# Altium schematic sheet PowerBoard.SchDoc: DriveHUB CardFrame - Backplane Power
size A3; Date: 01/08/22; Engineer: AJC; DocumentNumber: 35-735; Revision: D; SheetNumber: 1; SheetTotal: 3; Manager: AJC
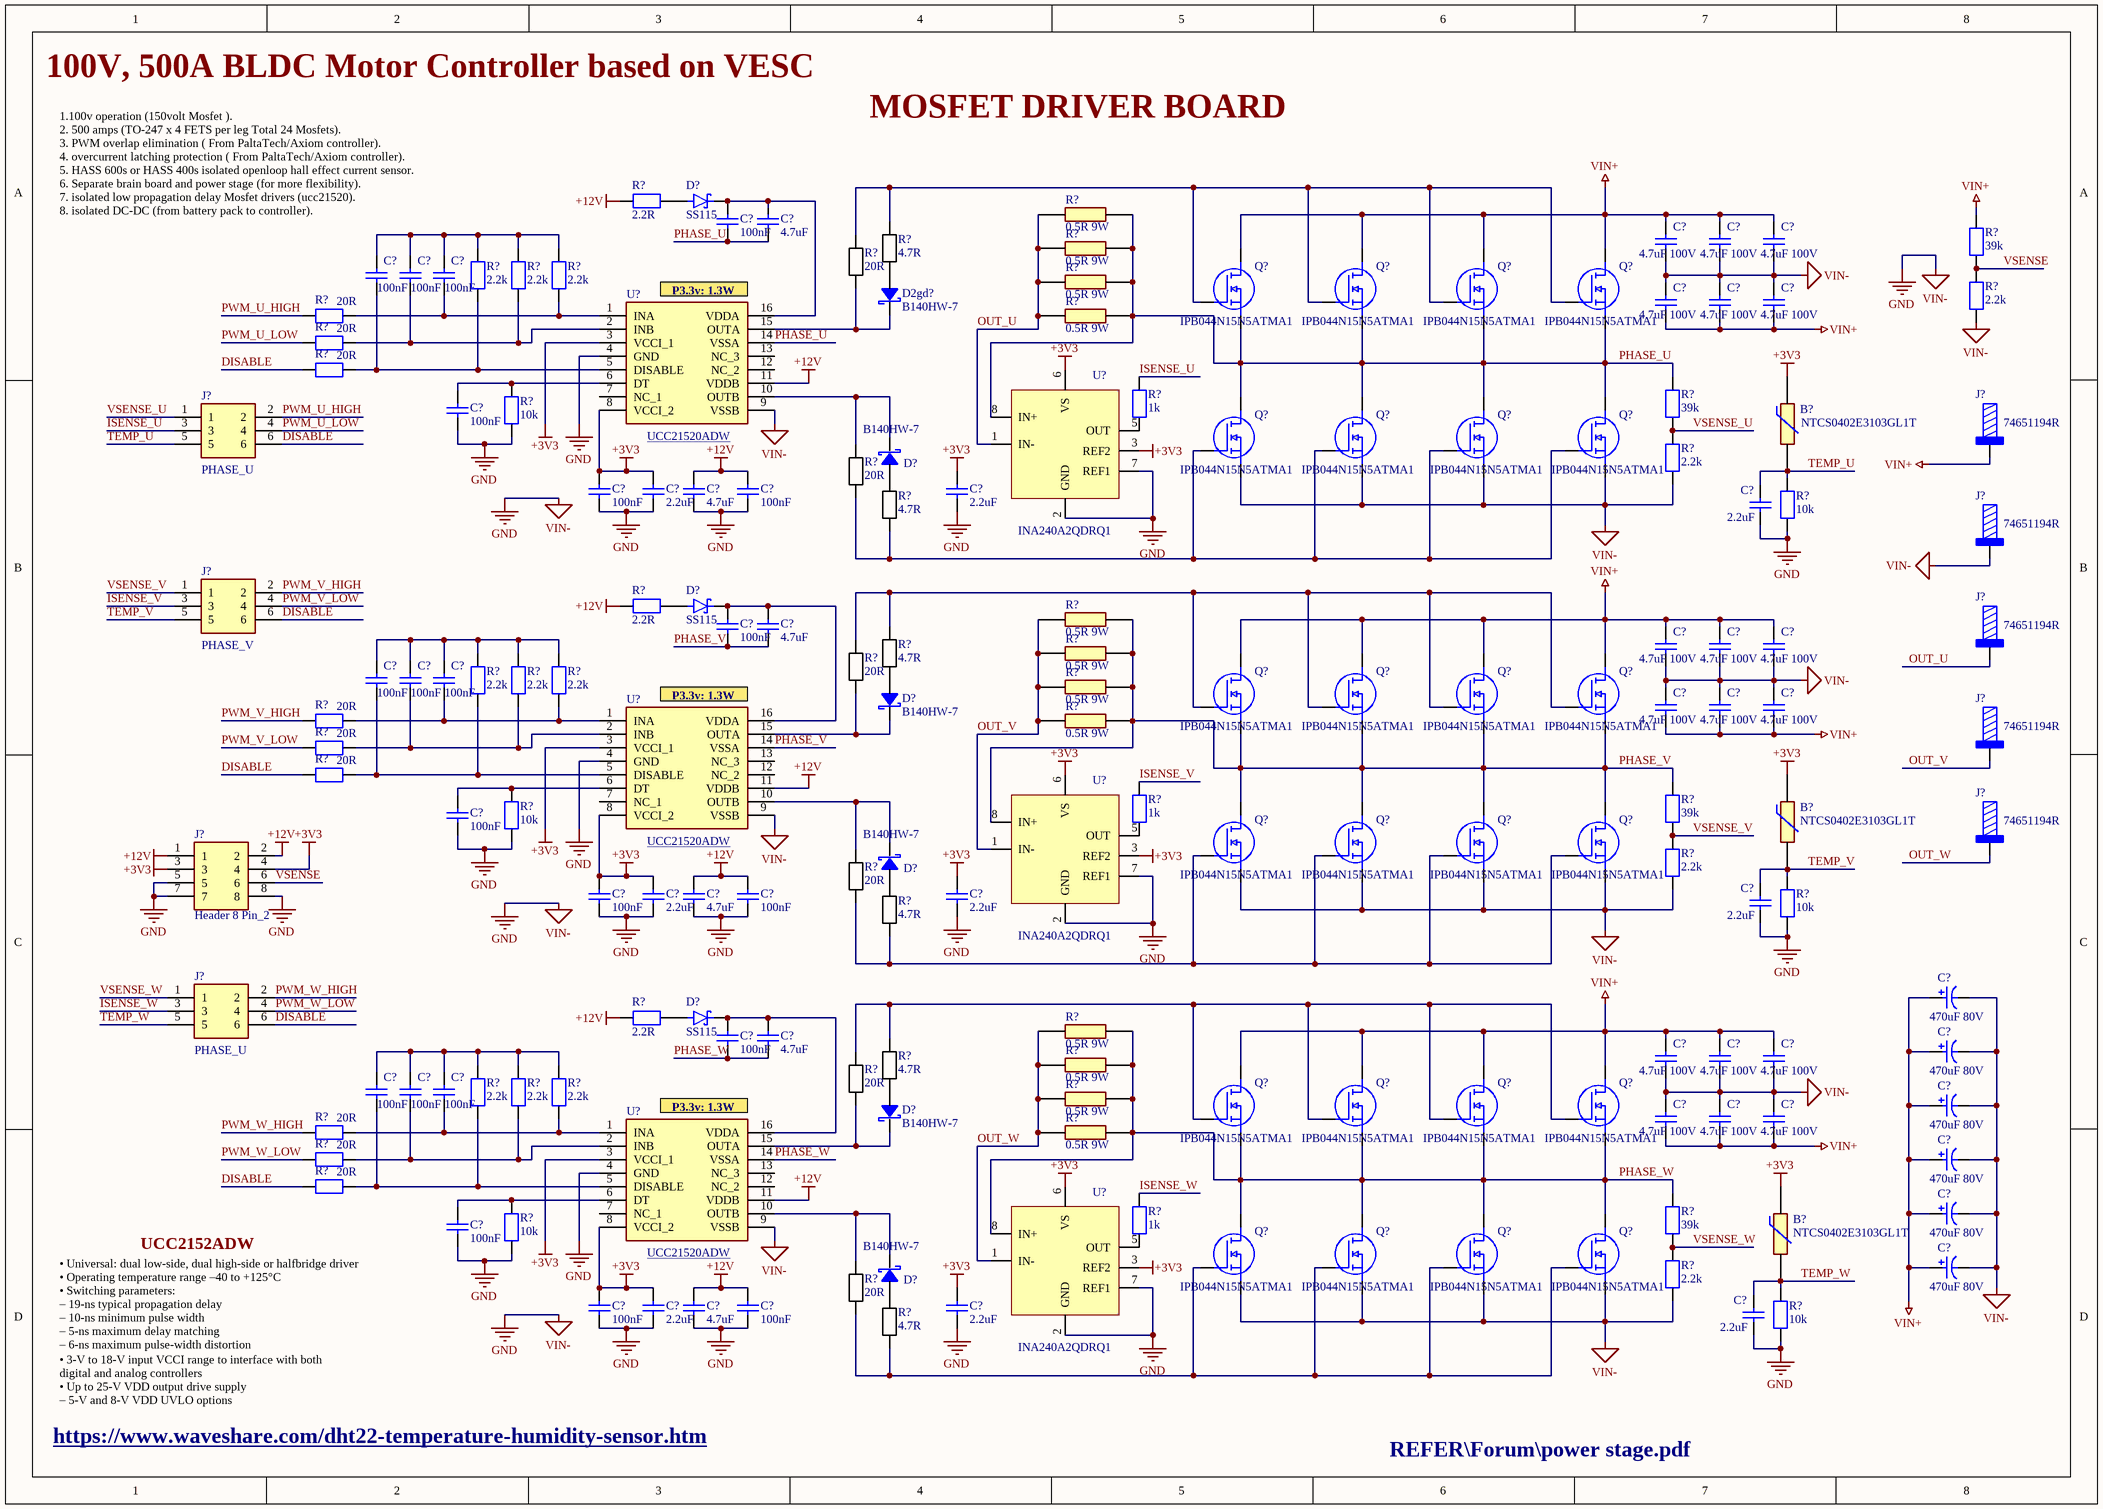
[diagram p0: PowerBoard.SchDoc]

## Parts
(Parts that share a designator on the sheet are numbered #1, #2 ... from top to bottom, then left to right.)
B?#1  NTCS0402E3103GL1T  [THRMC1005X65N]
B?#2  NTCS0402E3103GL1T  [THRMC1005X65N]
B?#3  NTCS0402E3103GL1T  [THRMC1005X65N]
C?#1  100nF  [C0402]
C?#2  4.7uF  [C0603]
C?#3  4.7uF 100V  [CAPC6153X300N]
C?#4  4.7uF 100V  [CAPC6153X300N]
C?#5  4.7uF 100V  [CAPC6153X300N]
C?#6  100nF  [C0402]
C?#7  100nF  [C0402]
C?#8  100nF  [C0402]
C?#9  4.7uF 100V  [CAPC6153X300N]
C?#10  4.7uF 100V  [CAPC6153X300N]
C?#11  4.7uF 100V  [CAPC6153X300N]
C?#12  100nF  [C0402]
C?#13  100nF  [C0402]
C?#14  2.2uF  [C0603]
C?#15  4.7uF  [C0603]
C?#16  100nF  [C0402]
C?#17  2.2uF  [C0603]
C?#18  2.2uF  [C0603]
C?#19  100nF  [C0402]
C?#20  4.7uF  [C0603]
C?#21  4.7uF 100V  [CAPC6153X300N]
C?#22  4.7uF 100V  [CAPC6153X300N]
C?#23  4.7uF 100V  [CAPC6153X300N]
C?#24  100nF  [C0402]
C?#25  100nF  [C0402]
C?#26  100nF  [C0402]
C?#27  4.7uF 100V  [CAPC6153X300N]
C?#28  4.7uF 100V  [CAPC6153X300N]
C?#29  4.7uF 100V  [CAPC6153X300N]
C?#30  100nF  [C0402]
C?#31  100nF  [C0402]
C?#32  2.2uF  [C0603]
C?#33  4.7uF  [C0603]
C?#34  100nF  [C0402]
C?#35  2.2uF  [C0603]
C?#36  2.2uF  [C0603]
C?#37  470uF 80V  [CAPPRD500W80D1250H3200]
C?#38  100nF  [C0402]
C?#39  4.7uF  [C0603]
C?#40  470uF 80V  [CAPPRD500W80D1250H3200]
C?#41  4.7uF 100V  [CAPC6153X300N]
C?#42  4.7uF 100V  [CAPC6153X300N]
C?#43  4.7uF 100V  [CAPC6153X300N]
C?#44  100nF  [C0402]
C?#45  100nF  [C0402]
C?#46  100nF  [C0402]
C?#47  470uF 80V  [CAPPRD500W80D1250H3200]
C?#48  4.7uF 100V  [CAPC6153X300N]
C?#49  4.7uF 100V  [CAPC6153X300N]
C?#50  4.7uF 100V  [CAPC6153X300N]
C?#51  470uF 80V  [CAPPRD500W80D1250H3200]
C?#52  470uF 80V  [CAPPRD500W80D1250H3200]
C?#53  100nF  [C0402]
C?#54  470uF 80V  [CAPPRD500W80D1250H3200]
C?#55  100nF  [C0402]
C?#56  2.2uF  [C0603]
C?#57  4.7uF  [C0603]
C?#58  100nF  [C0402]
C?#59  2.2uF  [C0603]
C?#60  2.2uF  [C0603]
D2gd?  B140HW-7  [SOD123]
D?#1  SS115  [DIOM4325X250N]
D?#2  B140HW-7  [SOD123]
D?#3  SS115  [DIOM4325X250N]
D?#4  B140HW-7  [SOD123]
D?#5  B140HW-7  [SOD123]
D?#6  SS115  [DIOM4325X250N]
D?#7  B140HW-7  [SOD123]
D?#8  B140HW-7  [SOD123]
J?#1  74651194R  [74651194]
J?#2  PHASE_U  [61300621121]
J?#3  74651194R  [74651194]
J?#4  PHASE_V  [61300621121]
J?#5  74651194R  [74651194]
J?#6  74651194R  [74651194]
J?#7  74651194R  [74651194]
J?#8  Header 8 Pin_2  [61300821121]
J?#9  PHASE_U  [61300621121]
Q?#1  IPB044N15N5ATMA1  [IPB044N15N5ATMA1]
Q?#2  IPB044N15N5ATMA1  [IPB044N15N5ATMA1]
Q?#3  IPB044N15N5ATMA1  [IPB044N15N5ATMA1]
Q?#4  IPB044N15N5ATMA1  [IPB044N15N5ATMA1]
Q?#5  IPB044N15N5ATMA1  [IPB044N15N5ATMA1]
Q?#6  IPB044N15N5ATMA1  [IPB044N15N5ATMA1]
Q?#7  IPB044N15N5ATMA1  [IPB044N15N5ATMA1]
Q?#8  IPB044N15N5ATMA1  [IPB044N15N5ATMA1]
Q?#9  IPB044N15N5ATMA1  [IPB044N15N5ATMA1]
Q?#10  IPB044N15N5ATMA1  [IPB044N15N5ATMA1]
Q?#11  IPB044N15N5ATMA1  [IPB044N15N5ATMA1]
Q?#12  IPB044N15N5ATMA1  [IPB044N15N5ATMA1]
Q?#13  IPB044N15N5ATMA1  [IPB044N15N5ATMA1]
Q?#14  IPB044N15N5ATMA1  [IPB044N15N5ATMA1]
Q?#15  IPB044N15N5ATMA1  [IPB044N15N5ATMA1]
Q?#16  IPB044N15N5ATMA1  [IPB044N15N5ATMA1]
Q?#17  IPB044N15N5ATMA1  [IPB044N15N5ATMA1]
Q?#18  IPB044N15N5ATMA1  [IPB044N15N5ATMA1]
Q?#19  IPB044N15N5ATMA1  [IPB044N15N5ATMA1]
Q?#20  IPB044N15N5ATMA1  [IPB044N15N5ATMA1]
Q?#21  IPB044N15N5ATMA1  [IPB044N15N5ATMA1]
Q?#22  IPB044N15N5ATMA1  [IPB044N15N5ATMA1]
Q?#23  IPB044N15N5ATMA1  [IPB044N15N5ATMA1]
Q?#24  IPB044N15N5ATMA1  [IPB044N15N5ATMA1]
R?#1  2.2R  [R1206]
R?#2  0.5R 9W  [RESC10052X137N]
R?#3  4.7R  [R1206]
R?#4  20R  [R1206]
R?#5  39k  [R0805]
R?#6  0.5R 9W  [RESC10052X137N]
R?#7  2.2k  [R0603]
R?#8  2.2k  [R0603]
R?#9  2.2k  [R0603]
R?#10  0.5R 9W  [RESC10052X137N]
R?#11  2.2k  [R0805]
R?#12  20R  [R1206]
R?#13  0.5R 9W  [RESC10052X137N]
R?#14  20R  [R1206]
R?#15  20R  [R1206]
R?#16  1k  [R0603]
R?#17  39k  [R0805]
R?#18  10k  [R0603]
R?#19  20R  [R1206]
R?#20  2.2k  [R0805]
R?#21  4.7R  [R1206]
R?#22  10k  [R0603]
R?#23  2.2R  [R1206]
R?#24  0.5R 9W  [RESC10052X137N]
R?#25  4.7R  [R1206]
R?#26  20R  [R1206]
R?#27  0.5R 9W  [RESC10052X137N]
R?#28  2.2k  [R0603]
R?#29  2.2k  [R0603]
R?#30  2.2k  [R0603]
R?#31  0.5R 9W  [RESC10052X137N]
R?#32  20R  [R1206]
R?#33  0.5R 9W  [RESC10052X137N]
R?#34  20R  [R1206]
R?#35  20R  [R1206]
R?#36  1k  [R0603]
R?#37  39k  [R0805]
R?#38  10k  [R0603]
R?#39  20R  [R1206]
R?#40  2.2k  [R0805]
R?#41  4.7R  [R1206]
R?#42  10k  [R0603]
R?#43  2.2R  [R1206]
R?#44  0.5R 9W  [RESC10052X137N]
R?#45  4.7R  [R1206]
R?#46  20R  [R1206]
R?#47  0.5R 9W  [RESC10052X137N]
R?#48  2.2k  [R0603]
R?#49  2.2k  [R0603]
R?#50  2.2k  [R0603]
R?#51  0.5R 9W  [RESC10052X137N]
R?#52  20R  [R1206]
R?#53  0.5R 9W  [RESC10052X137N]
R?#54  20R  [R1206]
R?#55  20R  [R1206]
R?#56  1k  [R0603]
R?#57  39k  [R0805]
R?#58  10k  [R0603]
R?#59  20R  [R1206]
R?#60  2.2k  [R0805]
R?#61  4.7R  [R1206]
R?#62  10k  [R0603]
U?#1  UCC21520ADW  [SOIC127P1030X265-16N]
U?#2  INA240A2QDRQ1  [SOIC127P600X175-8N]
U?#3  UCC21520ADW  [SOIC127P1030X265-16N]
U?#4  INA240A2QDRQ1  [SOIC127P600X175-8N]
U?#5  UCC21520ADW  [SOIC127P1030X265-16N]
U?#6  INA240A2QDRQ1  [SOIC127P600X175-8N]

## Nets
+3V3: B?#1.1 B?#2.1 B?#3.1 C?#13.2 C?#14.2 C?#17.2 C?#31.2 C?#32.2 C?#35.2 C?#55.2 C?#56.2 C?#59.2 J?#8.3 J?#8.4 U?#1.3(VCCI_1) U?#1.8(VCCI_2) U?#2.3(REF2) U?#2.6(VS) U?#3.3(VCCI_1) U?#3.8(VCCI_2) U?#4.3(REF2) U?#4.6(VS) U?#5.3(VCCI_1) U?#5.8(VCCI_2) U?#6.3(REF2) U?#6.6(VS)
+12V: C?#15.2 C?#16.2 C?#33.2 C?#34.2 C?#57.2 C?#58.2 J?#8.1 J?#8.2 R?#1.1 R?#23.1 R?#43.1 U?#1.11(VDDB) U?#3.11(VDDB) U?#5.11(VDDB)
GND: C?#3.1 C?#4.1 C?#5.1 C?#9.2 C?#10.2 C?#11.2 C?#12.1 C?#13.1 C?#14.1 C?#15.1 C?#16.1 C?#17.1 C?#18.1 C?#21.1 C?#22.1 C?#23.1 C?#27.2 C?#28.2 C?#29.2 C?#30.1 C?#31.1 C?#32.1 C?#33.1 C?#34.1 C?#35.1 C?#36.1 C?#37.2 C?#40.2 C?#41.1 C?#42.1 C?#43.1 C?#47.2 C?#48.2 C?#49.2 C?#50.2 C?#51.2 C?#52.2 C?#53.1 C?#54.2 C?#55.1 C?#56.1 C?#57.1 C?#58.1 C?#59.1 C?#60.1 J?#3.1 J?#8.5 J?#8.7 J?#8.8 Q?#5.SOURCE Q?#6.SOURCE Q?#7.SOURCE Q?#8.SOURCE Q?#13.SOURCE Q?#14.SOURCE Q?#15.SOURCE Q?#16.SOURCE Q?#21.SOURCE Q?#22.SOURCE Q?#23.SOURCE Q?#24.SOURCE R?#11.1 R?#18.1 R?#20.1 R?#22.1 R?#38.1 R?#40.1 R?#42.1 R?#58.1 R?#60.1 R?#62.1 U?#1.4(GND) U?#1.9(VSSB) U?#2.2(GND) U?#2.7(REF1) U?#3.4(GND) U?#3.9(VSSB) U?#4.2(GND) U?#4.7(REF1) U?#5.4(GND) U?#5.9(VSSB) U?#6.2(GND) U?#6.7(REF1)  [also labelled VIN-]
VIN+: C?#3.2 C?#4.2 C?#5.2 C?#9.1 C?#10.1 C?#11.1 C?#21.2 C?#22.2 C?#23.2 C?#27.1 C?#28.1 C?#29.1 C?#37.1 C?#40.1 C?#41.2 C?#42.2 C?#43.2 C?#47.1 C?#48.1 C?#49.1 C?#50.1 C?#51.1 C?#52.1 C?#54.1 J?#1.1 Q?#1.DRAIN Q?#2.DRAIN Q?#3.DRAIN Q?#4.DRAIN Q?#9.DRAIN Q?#10.DRAIN Q?#11.DRAIN Q?#12.DRAIN Q?#17.DRAIN Q?#18.DRAIN Q?#19.DRAIN Q?#20.DRAIN R?#5.2
DISABLE: J?#2.6 J?#4.6 J?#9.6 R?#15.1 R?#35.1 R?#55.1
ISENSE_U: J?#2.3 R?#16.2
ISENSE_V: J?#4.3 R?#36.2
ISENSE_W: J?#9.3 R?#56.2
OUT_U: J?#5.1 R?#2.1 R?#6.1 R?#10.1 R?#13.1 U?#2.1(IN-)
OUT_V: J?#6.1 R?#24.1 R?#27.1 R?#31.1 R?#33.1 U?#4.1(IN-)
OUT_W: J?#7.1 R?#44.1 R?#47.1 R?#51.1 R?#53.1 U?#6.1(IN-)
PHASE_U: C?#1.1 C?#2.1 Q?#1.SOURCE Q?#2.SOURCE Q?#3.SOURCE Q?#4.SOURCE Q?#5.DRAIN Q?#6.DRAIN Q?#7.DRAIN Q?#8.DRAIN R?#2.2 R?#6.2 R?#10.2 R?#13.2 R?#17.2 U?#1.14(VSSA) U?#2.8(IN+)
PHASE_V: C?#19.1 C?#20.1 Q?#9.SOURCE Q?#10.SOURCE Q?#11.SOURCE Q?#12.SOURCE Q?#13.DRAIN Q?#14.DRAIN Q?#15.DRAIN Q?#16.DRAIN R?#24.2 R?#27.2 R?#31.2 R?#33.2 R?#37.2 U?#3.14(VSSA) U?#4.8(IN+)
PHASE_W: C?#38.1 C?#39.1 Q?#17.SOURCE Q?#18.SOURCE Q?#19.SOURCE Q?#20.SOURCE Q?#21.DRAIN Q?#22.DRAIN Q?#23.DRAIN Q?#24.DRAIN R?#44.2 R?#47.2 R?#51.2 R?#53.2 R?#57.2 U?#5.14(VSSA) U?#6.8(IN+)
PWM_U_HIGH: J?#2.2 R?#12.1
PWM_U_LOW: J?#2.4 R?#14.1
PWM_V_HIGH: J?#4.2 R?#32.1
PWM_V_LOW: J?#4.4 R?#34.1
PWM_W_HIGH: J?#9.2 R?#52.1
PWM_W_LOW: J?#9.4 R?#54.1
TEMP_U: B?#1.2 C?#18.2 J?#2.5 R?#22.2
TEMP_V: B?#2.2 C?#36.2 J?#4.5 R?#42.2
TEMP_W: B?#3.2 C?#60.2 J?#9.5 R?#62.2
VSENSE: J?#8.6 R?#5.1 R?#11.2
VSENSE_U: J?#2.1 R?#17.1 R?#20.2
VSENSE_V: J?#4.1 R?#37.1 R?#40.2
VSENSE_W: J?#9.1 R?#57.1 R?#60.2
NetC?#1_2: C?#1.2 C?#2.2 D?#1.C(K) U?#1.16(VDDA)
NetC?#6_1: C?#6.1 R?#7.1 R?#15.2 U?#1.5(DISABLE)
NetC?#6_2: C?#6.2 C?#7.2 C?#8.2 R?#7.2 R?#8.2 R?#9.2
NetC?#7_1: C?#7.1 R?#8.1 R?#14.2 U?#1.2(INB)
NetC?#8_1: C?#8.1 R?#9.1 R?#12.2 U?#1.1(INA)
NetC?#12_2: C?#12.2 R?#18.2 U?#1.6(DT)
NetC?#19_2: C?#19.2 C?#20.2 D?#3.C(K) U?#3.16(VDDA)
NetC?#24_1: C?#24.1 R?#28.1 R?#35.2 U?#3.5(DISABLE)
NetC?#24_2: C?#24.2 C?#25.2 C?#26.2 R?#28.2 R?#29.2 R?#30.2
NetC?#25_1: C?#25.1 R?#29.1 R?#34.2 U?#3.2(INB)
NetC?#26_1: C?#26.1 R?#30.1 R?#32.2 U?#3.1(INA)
NetC?#30_2: C?#30.2 R?#38.2 U?#3.6(DT)
NetC?#38_2: C?#38.2 C?#39.2 D?#6.C(K) U?#5.16(VDDA)
NetC?#44_1: C?#44.1 R?#48.1 R?#55.2 U?#5.5(DISABLE)
NetC?#44_2: C?#44.2 C?#45.2 C?#46.2 R?#48.2 R?#49.2 R?#50.2
NetC?#45_1: C?#45.1 R?#49.1 R?#54.2 U?#5.2(INB)
NetC?#46_1: C?#46.1 R?#50.1 R?#52.2 U?#5.1(INA)
NetC?#53_2: C?#53.2 R?#58.2 U?#5.6(DT)
NetD2gd?_A: D2gd?.A R?#3.1
NetD2gd?_C: D2gd?.C R?#4.1 U?#1.15(OUTA)
NetD?#1_A: D?#1.A R?#1.2
NetD?#2_A: D?#2.A R?#21.2
NetD?#2_C: D?#2.C R?#19.2 U?#1.10(OUTB)
NetD?#3_A: D?#3.A R?#23.2
NetD?#4_A: D?#4.A R?#25.1
NetD?#4_C: D?#4.C R?#26.1 U?#3.15(OUTA)
NetD?#5_A: D?#5.A R?#41.2
NetD?#5_C: D?#5.C R?#39.2 U?#3.10(OUTB)
NetD?#6_A: D?#6.A R?#43.2
NetD?#7_A: D?#7.A R?#45.1
NetD?#7_C: D?#7.C R?#46.1 U?#5.15(OUTA)
NetD?#8_A: D?#8.A R?#61.2
NetD?#8_C: D?#8.C R?#59.2 U?#5.10(OUTB)
NetQ?#1_GATE: Q?#1.GATE Q?#2.GATE Q?#3.GATE Q?#4.GATE R?#3.2 R?#4.2
NetQ?#5_GATE: Q?#5.GATE Q?#6.GATE Q?#7.GATE Q?#8.GATE R?#19.1 R?#21.1
NetQ?#9_GATE: Q?#9.GATE Q?#10.GATE Q?#11.GATE Q?#12.GATE R?#25.2 R?#26.2
NetQ?#13_GATE: Q?#13.GATE Q?#14.GATE Q?#15.GATE Q?#16.GATE R?#39.1 R?#41.1
NetQ?#17_GATE: Q?#17.GATE Q?#18.GATE Q?#19.GATE Q?#20.GATE R?#45.2 R?#46.2
NetQ?#21_GATE: Q?#21.GATE Q?#22.GATE Q?#23.GATE Q?#24.GATE R?#59.1 R?#61.1
NetR?#16_1: R?#16.1 U?#2.5(OUT)
NetR?#36_1: R?#36.1 U?#4.5(OUT)
NetR?#56_1: R?#56.1 U?#6.5(OUT)

Not connected (* = marked no-connect by the designer): U?#1 7(NC_1) 12(NC_2) 13(NC_3); U?#3 7(NC_1) 12(NC_2) 13(NC_3); U?#5 7(NC_1) 12(NC_2) 13(NC_3)

## Notes on the sheet
- 100V, 500A BLDC Motor Controller based on VESC
- MOSFET DRIVER BOARD
- 1.100v operation (150volt Mosfet ).
  2. 500 amps (TO-247 x 4 FETS per leg Total 24 Mosfets).
  3. PWM overlap elimination ( From PaltaTech/Axiom controller).
  4. overcurrent latching protection ( From PaltaTech/Axiom controller).
  5. HASS 600s or HASS 400s isolated openloop hall effect current sensor.
  6. Separate brain board and power stage (for more flexibility).
  7. isolated low propagation delay Mosfet drivers (ucc21520).
  8. isolated DC-DC (from battery pack to controller).
- (near U?#1) P3.3v: 1.3W
- (near U?#3) P3.3v: 1.3W
- (near U?#5) P3.3v: 1.3W
- UCC2152ADW
- • Universal: dual low-side, dual high-side or halfbridge driver
  • Operating temperature range –40 to +125°C
  • Switching parameters:
  – 19-ns typical propagation delay
  – 10-ns minimum pulse width
  – 5-ns maximum delay matching
  – 6-ns maximum pulse-width distortion
- https://www.waveshare.com/dht22-temperature-humidity-sensor.htm
- • 3-V to 18-V input VCCI range to interface with both
  digital and analog controllers
  • Up to 25-V VDD output drive supply
  – 5-V and 8-V VDD UVLO options
- REFER\Forum\power stage.pdf

## Library data of the parts
B?#1-B?#3 = NTCS0402E3103GL1T: NTC Thermistors 10Kohms 2% AEC-Q200; Manufacturer: Vishay; Supplier Part Number: 594-NTCS402E3103GL1T; Supplier: Mouser; Manufacturer Part Number: NTCS0402E3103GL1T; Price: 0.47; Value: NTCS0402E3103GL1T
C?#1 C?#6-C?#8 C?#12 C?#13 C?#16 C?#19 C?#24-C?#26 C?#30 C?#31 C?#34 C?#38 C?#44-C?#46 C?#53 C?#55 C?#58 = 100nF ± 10% 50V: Manufacturer: Yageo; Manufacturer Part Number: CS0603KRX7R9BB104; Value: 100nF; Supplier: mouser; Supplier Part Number: 603-CS0603KRX79BB104; Price: 0.1
C?#2 C?#15 C?#20 C?#33 C?#39 C?#57 = 4.7uF ± 10% 50V: Manufacturer: Yageo; Manufacturer Part Number: GRM188R61H225ME11J; Value: 4.7uF; Supplier: mouser; Supplier Part Number: 81-GRM188R61H225ME1J; Price: 0.3
C?#3-C?#5 C?#9-C?#11 C?#21-C?#23 C?#27-C?#29 C?#41-C?#43 C?#48-C?#50 = 4.7uF ± 10% 100V: Capacitor KRM55 L=6.1mm W=5.3mm T=2.8mm; Manufacturer: Murata Electronics; Manufacturer Part Number: KRM55LR72A475KH01K; Supplier Part Number: 81-KRM55LR72A475KH1K; Supplier: Mouser; Price: 3.2; Value: 4.7uF 100V
C?#14 C?#17 C?#18 C?#32 C?#35 C?#36 C?#56 C?#59 C?#60 = 2.2uF ± 10% 50V: Manufacturer: Yageo; Manufacturer Part Number: GRM188R61H225ME11J; Value: 2.2uF; Supplier: mouser; Supplier Part Number: 81-GRM188R61H225ME1J; Price: 0.3
C?#37 C?#40 C?#47 C?#51 C?#52 C?#54 = 470uF 80V 2200mA: Aluminum Electrolytic Capacitors - Radial Leaded 80VDC 470uF 2200mA Polar; Manufacturer: Panasonic; Manufacturer Part Number: EEU-FS1K471L; Supplier Part Number: 667-EEU-FS1K471L; Supplier: Mouser; Value: 470uF 80V; Price: 2
D2gd? D?#2 D?#4 D?#5 D?#7 D?#8 = B140HW-7: Schottky Diodes & Rectifiers 1A, 40V; Value: B140HW-7; Manufacturer Part Number: B140HW-7; Manufacturer: Diodes; Supplier: Mouser; Supplier Part Number: 621-B140HW-7; Price: 0.42
D?#1 D?#3 D?#6 = SS115: Schottky Diodes & Rectifiers 1A, 150V, Schottky Rectifier; Manufacturer: Taiwan Semiconductor; Value: 1A, 150V; Price: 0.34; Supplier: Mouser; Manufacturer Part Number: SS115; Supplier Part Number: 821-SS115
J?#1 J?#3 J?#5-J?#7 = 74651194R: WP-THRSH REDCUBE THR with external thread, M4 x 5mm, 85A; Manufacturer: Wurth Elektronik; Surface: Tin; ComponentLink1Description: Website Link; ComponentLink1URL: https://www.we-online.com/redexpert/article/74651194R?ad; ComponentLink2Description: Datasheet Link; ComponentLink2URL: https://www.we-online.com/redexpert/spec/74651194R?ad; Manufacturer Part Number: 74651194R; Category: REDCUBE THR; Match Code: WP-THRSH; Mount: Through Hole Reflow; Operating Temperature Max: 150°C; Operating Temperature Min: -55°C; Packaging: Tape and Reel; Length: 10mm; Width: 10mm; Height: 8.5mm; Material: Brass; Number of Pins: 9; Rated Current: 85A; Thread Length: 5mm; Thread Size: M4; Supplier: Mouser; Supplier Part Number: 710-74651195R; Price: 3.5; Value: 74651194R
J?#2 J?#4 J?#9 = Header 6 Pin_2: WR-PHD 2.54mm  Dual Pin Header THT 06p Wurth Elektronik WR-PHD Series, Series Number 6130, 2.54mm Pitch 6 Way 2 Row Straight PCB Header, Solder Termination; Value: 61300621121; Supplier Part Number: 710-61300621121; Supplier: Mouser; Manufacturer: Wurth Elektronik; Manufacturer Part Number: 61300621121; Price: 0.57
J?#8 = Header 8 Pin_2: Headers & Wire Housings WR-PHD 2.54mm Hdr 8P Dual Str Gold; Manufacturer: Wurth Elektronik; Value: 61300821121; Supplier Part Number: 710-61300621121; Supplier: Mouser; Manufacturer Part Number: 61300821121; Price: 0.7
Q?#1-Q?#24 = IPB044N15N5ATMA1: INFINEON - IPB044N15N5ATMA1 - Power MOSFET, N Channel, 150 V, 174 A, 0.0034 ohm, TO-263 (D2PAK), Surface Mount; Supplier Part Number: 726-IPB044N15N5ATMA1; Supplier: Mouser; Manufacturer: Infineon; Manufacturer Part Number: IPB044N15N5ATMA1; Price: 12.76; Value: IPB044N15N5ATMA1
R?#1 R?#23 R?#43 = 2.2ohm 0.25W ±1%: 2.2 ohm 0.25W ±1%; Manufacturer Part Number: RC1206FR-072R2L; Manufacturer: Yageo; Value: 2.2R; Supplier: Mouser; Supplier Part Number: 603-RC1206FR-072R2L; Price: 0.12
R?#2 R?#6 R?#10 R?#13 R?#24 R?#27 R?#31 R?#33 R?#44 R?#47 R?#51 R?#53 = CSS2H-3920R-L500FE: Current Sense Resistors - SMD 0.5mOHMS 9W 1% AEC-Q200; Manufacturer: Bourns; Value: 0.5ohm 9W; Supplier Part Number: 652-CSS2H3920RL500FE; Supplier: Mouser; Manufacturer Part Number: CSS2H-3920R-L500FE; Price: 2
R?#3 R?#21 R?#25 R?#41 R?#45 R?#61 = 4.7 ohm 0.25W ±1%: Manufacturer Part Number: RC1206FR-074R7L; Manufacturer: Yageo; Value: 4.7R; Supplier: Mouser; Supplier Part Number: 603-RC1206FR-074R7L; Price: 0.12
R?#4 R?#19 R?#26 R?#39 R?#46 R?#59 = 20 ohm 0.25W ±1%: Manufacturer Part Number: RC1206FR-0720RL; Manufacturer: Yageo; Value: 20R; Supplier: Mouser; Supplier Part Number: 603-RC1206FR-0720RL; Price: 0.12
R?#5 R?#17 R?#37 R?#57 = 39 kOhms ±1% 0.8W: Manufacturer: Yageo; Manufacturer Part Number: RT0805FRE0739KL; Value: 39k; Supplier: mouser; Supplier Part Number: 603-RT0805FRE0739KL; Price: 0.1
R?#7-R?#9 R?#28-R?#30 R?#48-R?#50 = 2.2 kOhms ±1% 0.1W: Manufacturer: Yageo; Manufacturer Part Number: RC0603FR-072K2L; Value: 2.2k; Supplier: Mouser; Supplier Part Number: 603-RC0603FR-072K2L; Price: 0.1
R?#11 R?#20 R?#40 R?#60 = 2.2 kOhms ±1% 0.8W: Manufacturer: Yageo; Manufacturer Part Number: RT0805FRE072K2L; Value: 2.2k; Supplier: mouser; Supplier Part Number: 603-RT0805FRE072K2L; Price: 0.1
R?#12 R?#14 R?#15 R?#32 R?#34 R?#35 R?#52 R?#54 R?#55 = 20ohm 0.25W ±1%: 20 ohm 0.25W ±1%; Manufacturer Part Number: RC1206FR-0720RL; Manufacturer: Yageo; Value: 20R; Supplier: Mouser; Supplier Part Number: 603-RC1206FR-0720RL; Price: 0.12
R?#16 R?#36 R?#56 = 1 kOhms ±1% 0.1W: Manufacturer: Yageo; Manufacturer Part Number: RC0603FR-071KL; Value: 1k; Supplier: Mouser; Supplier Part Number: 603-RC0603FR-071KL; Price: 0.1
R?#18 R?#22 R?#38 R?#42 R?#58 R?#62 = 10 kOhms ±1% 0.1W: Manufacturer: Yageo; Manufacturer Part Number: RC0603FR-0710KL; Value: 10k; Supplier: mouser; Supplier Part Number: 603-RC0603FR-0710KL; Price: 0.1
U?#1 U?#3 U?#5 = UCC21520ADW: 4A/6A, 5.7 kVrms Isolated Dual Channel Gate Driver; Manufacturer: Texas Instruments; Supplier Part Number: 595-UCC21520ADW; Value: UCC21520ADW; Manufacturer Part Number: UCC21520ADW; Price: 7.6; Supplier: Mouser
U?#2 U?#4 U?#6 = INA240A2QDRQ1: Automotive, High/Low Side, Bi-Directional Zer-Drift Current Sense Amp w/ Enhanced PWM Rejection; Manufacturer: Texas Instruments; Supplier Part Number: 595-INA240A2QDRQ1; Supplier: Mouser; Manufacturer Part Number: INA240A2QDRQ1; Price: 3.8; Value: INA240A2QDRQ1